# Altium schematic sheet Analog.SchDoc
size A2
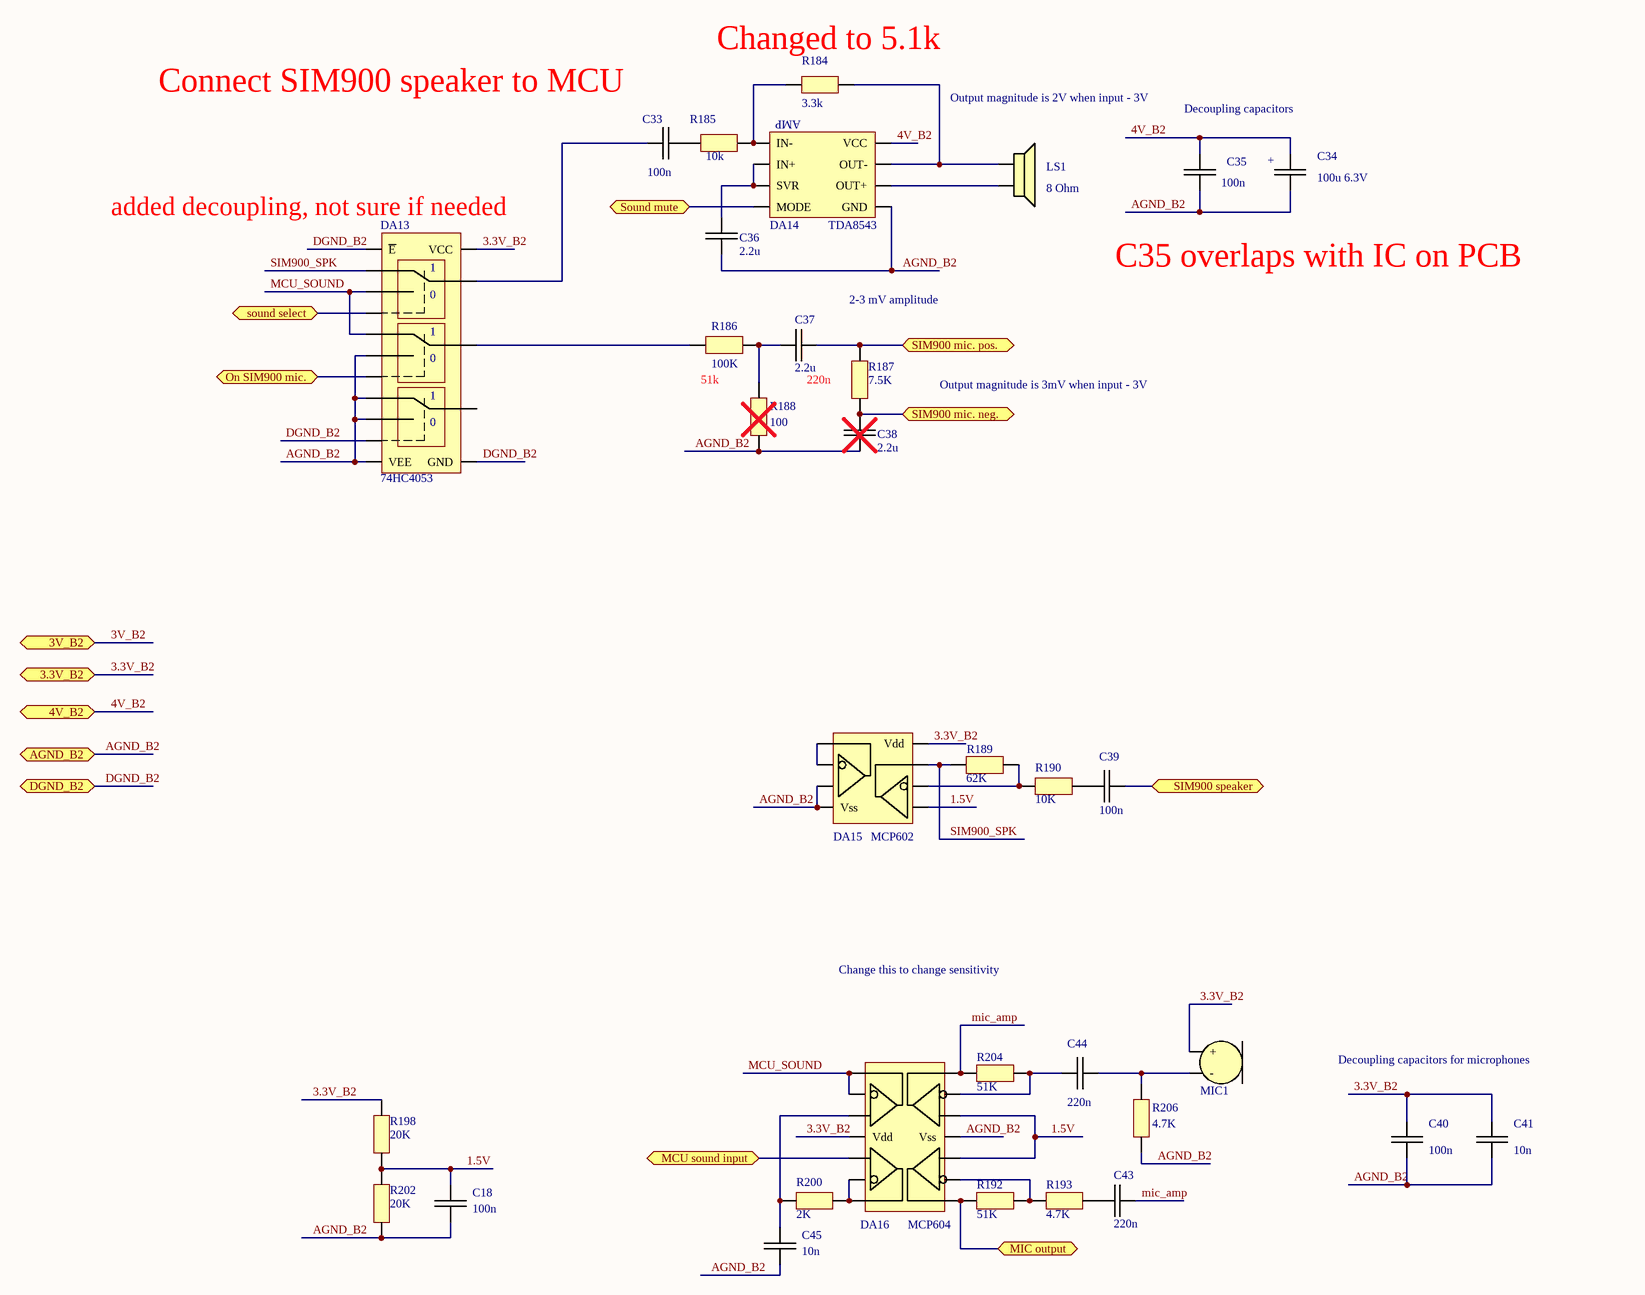
[diagram p0: Analog.SchDoc]

## Parts
C18  100n  [0805]
C33  100n  [0805]
C34  100u 6.3V  [CALUM_SMD_C]
C35  100n  [0805]
C36  2.2u  [0805]
C37  2.2u  [0805]
C38  2.2u  [0805]
C39  100n  [0805]
C40  100n  [0805]
C41  10n  [0805]
C43  220n  [0805]
C44  220n  [0805]
C45  10n  [0805]
DA13  74HC4053  [SOP16]
DA14  TDA8543  [SOP16]
DA15  MCP602  [SOP8]
DA16  MCP604  [SOP14]
LS1  8 Ohm  [PLS_2]
MIC1  MIC  [MIC_6.0x5.2]  (value not drawn)
R184  3.3k  [0805]
R185  10k  [0805]
R186  100K  [0805]
R187  7.5K  [0805]
R188  100  [0805]
R189  62K  [0805]
R190  10K  [0805]
R192  51K  [0805]
R193  4.7K  [0805]
R198  20K  [0805]
R200  2K  [0805]
R202  20K  [0805]
R204  51K  [0805]
R206  4.7K  [0805]

## Ports
3.3V_B2, 3V_B2, 4V_B2, AGND_B2, DGND_B2, MCU sound input, MIC output, On SIM900 mic., SIM900 mic. neg., SIM900 mic. pos., SIM900 speaker, Sound mute, sound select

## Nets
1.5V: C18.2 DA15.5 DA16.10 DA16.12 R198.2 R202.1
3.3V_B2: C40.2 C41.2 DA13.16(VCC) DA15.8(Vdd) DA16.4(Vdd) MIC1.+ R198.1 ; port 3.3V_B2
3V_B2: port 3V_B2
4V_B2: C34.1 C35.2 DA14.12(VCC) ; port 4V_B2
AGND_B2: C18.1 C34.2 C35.1 C36.2 C38.2 C40.1 C41.1 C45.1 DA13.5 DA13.7(VEE) DA13.12 DA13.13 DA14.13(GND) DA15.3 DA15.4(Vss) DA16.11(Vss) R188.2 R202.2 R206.2 ; port AGND_B2
DGND_B2: DA13.6(~{E}) DA13.8(GND) DA13.11 ; port DGND_B2
MCU sound input: DA16.5 ; port MCU sound input
MCU_SOUND: DA13.2 DA13.3 DA16.1 DA16.2
MIC output: DA16.8 R192.1 ; port MIC output
mic_amp: C43.2 DA16.14 R204.1
On SIM900 mic.: DA13.9 ; port On SIM900 mic.
SIM900 mic. neg.: C38.1 R187.2 ; port SIM900 mic. neg.
SIM900 mic. pos.: C37.1 R187.1 ; port SIM900 mic. pos.
SIM900 speaker: C39.2 ; port SIM900 speaker
SIM900_SPK: DA13.1 DA15.7 R189.2
Sound mute: DA14.3(MODE) ; port Sound mute
sound select: DA13.10 ; port sound select
NetC33_1: C33.1 DA13.15
NetC33_2: C33.2 R185.2
NetC36_1: C36.1 DA14.4(SVR) DA14.5(IN+)
NetC37_2: C37.2 R186.2 R188.1
NetC39_1: C39.1 R190.1
NetC43_1: C43.1 R193.1
NetC44_1: C44.1 DA16.13 R204.2
NetC44_2: C44.2 MIC1.- R206.1
NetC45_2: C45.2 DA16.3 R200.2
NetDA13_4: DA13.4 R186.1
NetDA14_6: DA14.6(IN-) R184.2 R185.1
NetDA14_11: DA14.11(OUT-) LS1.1 R184.1
NetDA14_14: DA14.14(OUT+) LS1.2
NetDA15_1: DA15.1 DA15.2
NetDA15_6: DA15.6 R189.1 R190.2
NetDA16_6: DA16.6 DA16.7 R200.1
NetDA16_9: DA16.9 R192.2 R193.2

Not connected (* = marked no-connect by the designer): DA13 14

## Notes on the sheet
- Connect SIM900 speaker to MCU
- (near R184) Changed to 5.1k
- Output magnitude is 2V when input - 3V
- Decoupling capacitors
- (near DA13) added decoupling, not sure if needed
- 2-3 mV amplitude
- C35 overlaps with IC on PCB
- 51k
- 220n
- Output magnitude is 3mV when input - 3V
- Change this to change sensitivity
- Decoupling capacitors for microphones
- (in symbol 74HCx4053) 0
- (in symbol C_POL) +
- (in symbol TDA8543) AMP

## Library data of the parts
C18 C33 C35-C41 C43-C45 = C
C34 = C_POL
DA13 = 74HCx4053
DA15 = 2xOP.AMP
DA16 = 4xOP.AMP
LS1 = Speaker
R184-R190 R192 R193 R198 R200 R202 R204 R206 = R